# Altium schematic sheet [01] - COVER PAGE.SchDoc
size A3; DocumentNumber: 2; SheetNumber: 2; SheetTotal: 9
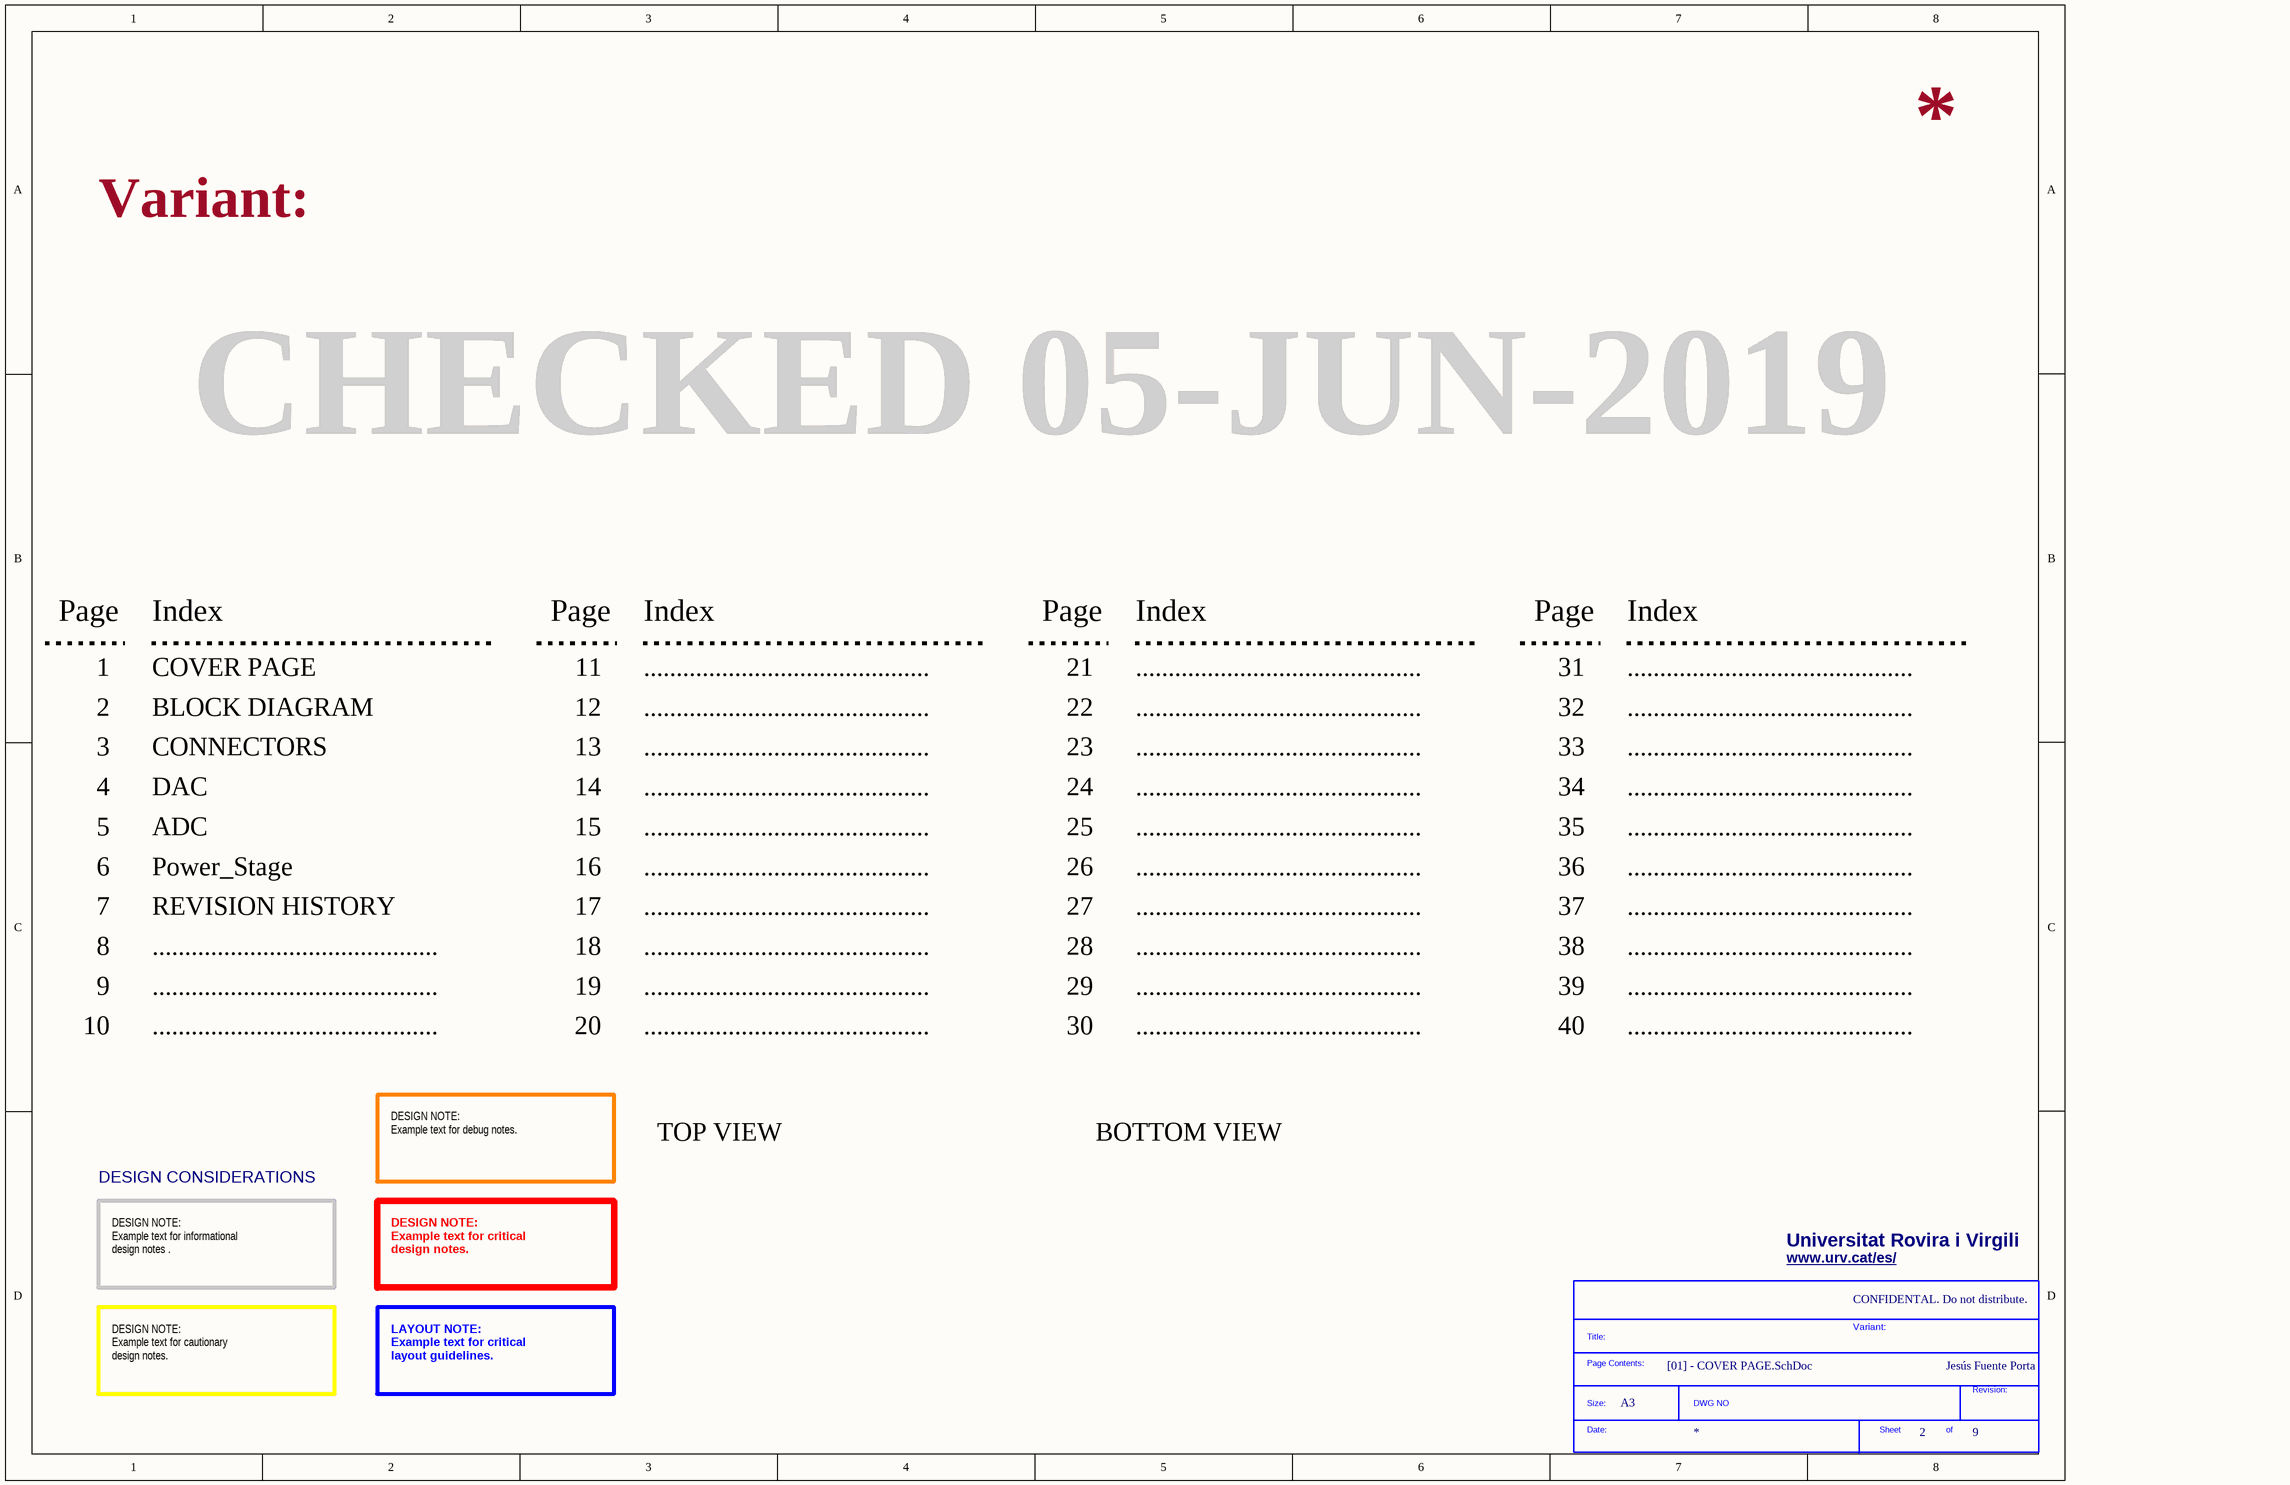
[diagram p0: [01] - COVER PAGE.SchDoc]

## Parts
*  SDTitleBlock  (value not drawn)  (graphical)

## Notes on the sheet
- Variant:
- CHECKED 05-JUN-2019
- Page
- Index
- 1
- COVER PAGE
- 11
- ............................................
- 21
- 31
- 2
- 3
- BLOCK DIAGRAM
- CONNECTORS
- 12
- 13
- 22
- 23
- 32
- 33
- 4
- 5
- DAC
- ADC
- 14
- 15
- 24
- 25
- 34
- 35
- 6
- Power_Stage
- 16
- 26
- 36
- 7
- 8
- REVISION HISTORY
- 17
- 18
- 27
- 28
- 37
- 38
- 9
- 10
- 19
- 20
- 29
- 30
- 39
- 40
- DESIGN NOTE:
  Example text for debug notes.
- TOP VIEW
- BOTTOM VIEW
- DESIGN CONSIDERATIONS
- Universitat Rovira i Virgili
- DESIGN NOTE:
  Example text for informational
  design notes .
- DESIGN NOTE:
  Example text for critical
  design notes.
- www.urv.cat/es/ <http://www.urv.cat/es/>
- CONFIDENTAL. Do not distribute.
- Jesús Fuente Porta
- DESIGN NOTE:
  Example text for cautionary
  design notes.
- LAYOUT NOTE:
  Example text for critical
  layout guidelines.
- A3
- (in symbol SDTitleBlock) Title:; Page Contents:; Revision:; Size:; DWG NO; Date:; Sheet; of